# Altium schematic sheet Half_bridge_drivers.SchDoc
size B; DocumentNumber: 3; SheetNumber: 2; SheetTotal: 7
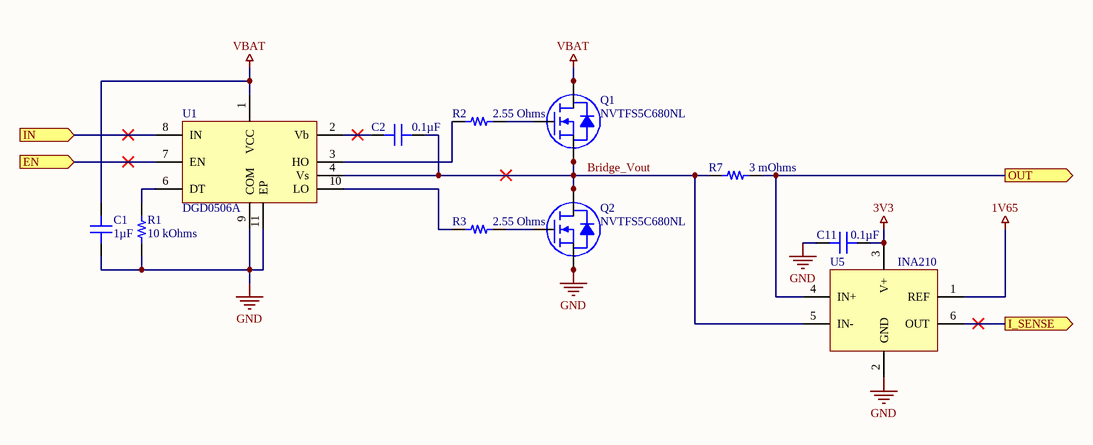
[diagram p0: Half_bridge_drivers.SchDoc]

## Parts
C1  1µF  [CAP 0603_1608]
C2  0.1µF  [CAP 0603_1608]
C11  0.1µF  [CAP 0603_1608]
Q1  NVTFS5C680NL  [NVTFS015N04CTAG]
Q2  NVTFS5C680NL  [NVTFS015N04CTAG]
R1  10 kOhms  [RES 0603_1608]
R2  2.55 Ohms  [RES 0603_1608]
R3  2.55 Ohms  [RES 0603_1608]
R7  3 mOhms  [STACKPOLE CSR0603]
U1  DGD0506A  [10-WDFN3030]
U5  INA210  [TI SC70-6 DCK]

## Ports
EN (in), I_SENSE (out), IN (in), OUT (out)

## Nets
1V65: U5.1(REF)
3V3: C11.2 U5.3(V+)
GND: C1.1 C11.1 Q2.1(S) Q2.2(S) Q2.3(S) R1.2 U1.9(COM) U1.11(EP) U5.2(GND)
VBAT: C1.2 Q1.5(D) Q1.6(D) Q1.7(D) Q1.8(D) U1.1(VCC)
Bridge_Vout: C2.1 Q1.1(S) Q1.2(S) Q1.3(S) Q2.5(D) Q2.6(D) Q2.7(D) Q2.8(D) R7.1 U1.4(Vs) U5.5(IN-)
EN: U1.7(EN) ; port EN
I_SENSE: U5.6(OUT) ; port I_SENSE
IN: U1.8(IN) ; port IN
OUT: R7.2 U5.4(IN+) ; port OUT
NetC2_2: C2.2 U1.2(Vb)
NetQ1_4: Q1.4(G) R2.2
NetQ2_4: Q2.4(G) R3.2
NetR1_1: R1.1 U1.6(DT)
NetR2_1: R2.1 U1.3(HO)
NetR3_1: R3.1 U1.10(LO)

## Library data of the parts
C1 = GCJ188R71E105KA01D: CAP CER 1UF 25V X7R 0603; Manufacturer: Murata Electronics; Tolerance: ±10%; Part Number: GCJ188R71E105KA01D; Value: 1µF; Applications: Automotive, Boardflex Sensitive; Capacitance: 1µF; ComponentLink1Description: Datasheet; ComponentLink1URL: https://search.murata.co.jp/Ceramy/image/img/A01X/G101/ENG/GCJ188R71E105KA01-01.pdf; ComponentLink2Description: DigiKey Link; ComponentLink2URL: http://digikey.com/product-detail/en/murata-electronics/GCJ188R71E105KA01D/490-14409-1-ND/6606870; Device Package: 0603 (1608 Metric); Features: Soft Termination; LastUpdated: 21-Jan-20 12:01:58 AM; Lifecycle Status: Active; Minimum Order: 1; Mounting Type: Surface Mount, MLCC; Operating Temperature: -55°C ~ 125°C; Package / Case: 0603 (1608 Metric); Packaging: TapeAndReel; PartId: 9566; Part Status: Active; Price: 0.05; Ratings: AEC-Q200; Series: GCJ; Size / Dimension: 0.063" L x 0.031" W (1.60mm x 0.80mm); Supplier 1: DigiKey; Supplier Part Number 1: 490-14409-1-ND; Temperature Coefficient: X7R; Thickness (Max): 0.035" (0.90mm); Voltage - Rated: 25V
C2 C11 = GCG188R92A104KA03D: CAP CER 0.1UF 100V 0603 EPOXY; Manufacturer: Murata Electronics; Temperature Coefficient: X8R; Tolerance: ±10%; Part Number: GCG188R92A104KA03D; Value: 0.1µF; Applications: Automotive; Capacitance: 0.1µF; ComponentLink1Description: Datasheet; ComponentLink1URL: https://search.murata.co.jp/Ceramy/image/img/A01X/G101/ENG/GCG188R92A104KA03-01.pdf; ComponentLink2Description: DigiKey Link; ComponentLink2URL: http://digikey.com/product-detail/en/murata-electronics/GCG188R92A104KA03D/490-18197-1-ND/9867926; Device Package: 0603 (1608 Metric); Features: Epoxy Mountable; LastUpdated: 21-Jan-20 12:01:59 AM; Lifecycle Status: Active; Minimum Order: 1; Mounting Type: Surface Mount, MLCC, Epoxy; Operating Temperature: -55°C ~ 150°C; Package / Case: 0603 (1608 Metric); Packaging: TapeAndReel; PartId: 9025; Part Status: Active; Price: 0.07; Ratings: AEC-Q200; Series: GCG; Size / Dimension: 0.063" L x 0.031" W (1.60mm x 0.80mm); Supplier 1: DigiKey; Supplier Part Number 1: 490-18197-1-ND; Thickness (Max): 0.035" (0.90mm); Voltage - Rated: 100V
R1 = RNCS0603BKE10K0: RES 10K OHM 0.1% 1/16W 0603; Manufacturer: Stackpole Electronics Inc; Power (Watts): 0.063W, 1/16W; Temperature Coefficient: ±25ppm/°C; Part Number: RNCS0603BKE10K0; Value: 10 kOhms; ComponentLink1Description: Datasheet; ComponentLink1URL: https://www.seielect.com/catalog/sei-rncs_rnch.pdf; ComponentLink2Description: DigiKey Link; ComponentLink2URL: http://digikey.com/product-detail/en/stackpole-electronics-inc/RNCS0603BKE10K0/RNCS0603BKE10K0CT-ND/1800113; Composition: Thin Film; Device Package: 0603 (1608 Metric); Features: Anti-Corrosive, Automotive AEC-Q200, Moisture Resistant; Height - Seated (Max): 0.022" (0.55mm); LastUpdated: 21-Jan-20 12:25:01 AM; Lifecycle Status: Active; Minimum Order: 1; Number of Terminations: 2; Operating Temperature: -55°C ~ 155°C; Package / Case: 0603 (1608 Metric); Packaging: TapeAndReel; PartId: 4838; Part Status: Active; Price: 0.08; Ratings: AEC-Q200; Resistance: 10 kOhms; Series: RNCS; Size / Dimension: 0.061" L x 0.031" W (1.55mm x 0.80mm); Supplier 1: DigiKey; Supplier Part Number 1: RNCS0603BKE10K0CT-ND; Supplier Device Package: 0603; Tolerance: ±0.1%
R2 R3 = CRCW06032R55FKEA: RES SMD 2.55 OHM 1% 1/10W 0603; Manufacturer: Vishay Dale; Power (Watts): 0.1W, 1/10W; Temperature Coefficient: ±100ppm/°C; Part Number: CRCW06032R55FKEA; Value: 2.55 Ohms; ComponentLink1Description: Datasheet; ComponentLink1URL: http://www.vishay.com/docs/20035/dcrcwe3.pdf; ComponentLink2Description: DigiKey Link; ComponentLink2URL: http://digikey.com/product-detail/en/vishay-dale/CRCW06032R55FKEA/541-2.55HHCT-ND/1962041; Composition: Thick Film; Device Package: 0603 (1608 Metric); Features: Automotive AEC-Q200; Height - Seated (Max): 0.020" (0.50mm); LastUpdated: 21-Jan-20 12:16:55 AM; Lifecycle Status: Active; Minimum Order: 1; Number of Terminations: 2; Operating Temperature: -55°C ~ 155°C; Package / Case: 0603 (1608 Metric); Packaging: CutTape; PartId: 23466; Part Status: Active; Price: 0.10; Ratings: AEC-Q200; Resistance: 2.55 Ohms; Series: CRCW; Size / Dimension: 0.061" L x 0.033" W (1.55mm x 0.85mm); Supplier 1: DigiKey; Supplier Part Number 1: 541-2.55HHCT-ND; Supplier Device Package: 0603; Tolerance: ±1%
R7 = CSS0603FT3L00: RES SHUNT, 0603, 0.003 OHM, 1%,; Manufacturer: Stackpole Electronics Inc; Power (Watts): 0.333W, 1/3W; Temperature Coefficient: ±100ppm/°C; Part Number: CSS0603FT3L00; ComponentLink2Description: DigiKey Link; ComponentLink2URL: http://digikey.com/product-detail/en/stackpole-electronics-inc/CSS0603FT3L00/738-CSS0603FT3L00CT-ND/10719388; Composition: Metal Element; Device Package: 0603 (1608 Metric); Features: Automotive AEC-Q200, Current Sense; Height - Seated (Max): 0.026" (0.65mm); LastUpdated: 19-Jul-20 11:45:32 PM; Lifecycle Status: Active; Minimum Order: 1; Number of Terminations: 2; Operating Temperature: -55°C ~ 155°C; Packaging: TapeAndReel; PartId: 1932; Part Status: Active; Price: 0.10; Ratings: AEC-Q200; Resistance: 3 mOhms; Series: CSS; Size / Dimension: 0.063" L x 0.031" W (1.60mm x 0.80mm); Supplier 1: DigiKey; Supplier Part Number 1: 738-CSS0603FT3L00CT-ND; Supplier Device Package: 0603; Tolerance: ±1%; Value: 3 mOhms
U1 = DGD0506A: Half Bridge driver - N FET
U5 = INA210: Current sense amplifier